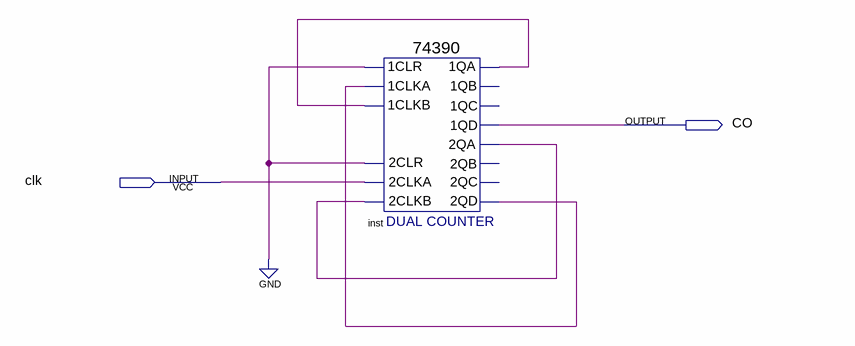
[diagram p0: schematic sheet]
// Quartus schematic m100.bdf as structural Verilog: 1 symbols, 2 pins
module m100 (
  input  clk,
  output CO
);

  wire inst_1qa, inst_2qa, inst_2qd;

  \74390  inst (
    .\2CLKA (clk), .\2CLR (1'b0), .\2CLKB (inst_2qa), .\1CLR (1'b0), .\1CLKA (inst_2qd), .\1CLKB (inst_1qa),
    .\1QA (inst_1qa), .\1QD (CO), .\2QA (inst_2qa), .\2QD (inst_2qd));  // open: 1QB, 1QC, 2QB, 2QC
endmodule
